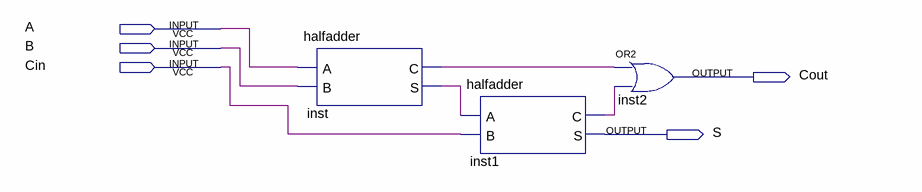
[diagram p0: schematic sheet]
// Quartus schematic fulladder2.bdf as structural Verilog: 3 symbols, 5 pins
module fulladder2 (
  input  A,
  input  B,
  input  Cin,
  output Cout,
  output S
);

  wire inst1_c, inst_c, inst_s;

  halfadder inst (.A(A), .B(B), .C(inst_c), .S(inst_s));
  halfadder inst1 (.A(inst_s), .B(Cin), .C(inst1_c), .S(S));
  or inst2 (Cout, inst_c, inst1_c);
endmodule
